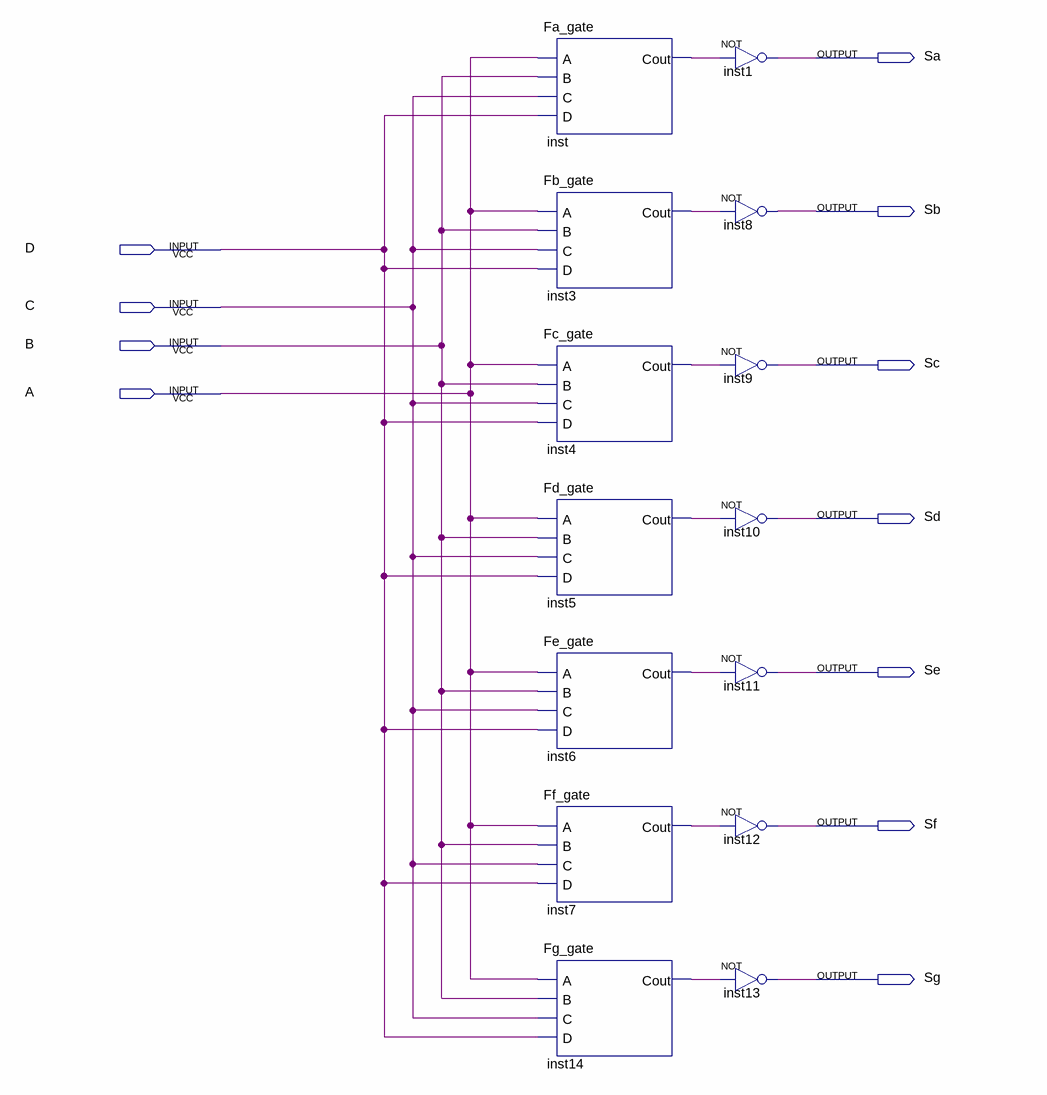
[diagram p0: schematic sheet]
// Quartus schematic conversorHex.bdf as structural Verilog: 14 symbols, 11 pins
module conversorHex (
  input  D,
  input  C,
  input  B,
  input  A,
  output Sa,
  output Sb,
  output Sc,
  output Sd,
  output Se,
  output Sf,
  output Sg
);

  wire inst3_cout, inst4_cout, inst5_cout, inst6_cout, inst7_cout, inst14_cout, inst_cout;

  Fa_gate inst (.A(A), .B(B), .C(C), .D(D), .Cout(inst_cout));
  Fb_gate inst3 (.A(A), .B(B), .C(C), .D(D), .Cout(inst3_cout));
  Fc_gate inst4 (.A(A), .B(B), .C(C), .D(D), .Cout(inst4_cout));
  Fd_gate inst5 (.A(A), .B(B), .C(C), .D(D), .Cout(inst5_cout));
  Fe_gate inst6 (.A(A), .B(B), .C(C), .D(D), .Cout(inst6_cout));
  Ff_gate inst7 (.A(A), .B(B), .C(C), .D(D), .Cout(inst7_cout));
  Fg_gate inst14 (.A(A), .B(B), .C(C), .D(D), .Cout(inst14_cout));
  not inst1 (Sa, inst_cout);
  not inst8 (Sb, inst3_cout);
  not inst9 (Sc, inst4_cout);
  not inst10 (Sd, inst5_cout);
  not inst11 (Se, inst6_cout);
  not inst12 (Sf, inst7_cout);
  not inst13 (Sg, inst14_cout);
endmodule
